# EAGLE design main (EAGLE 6.4)
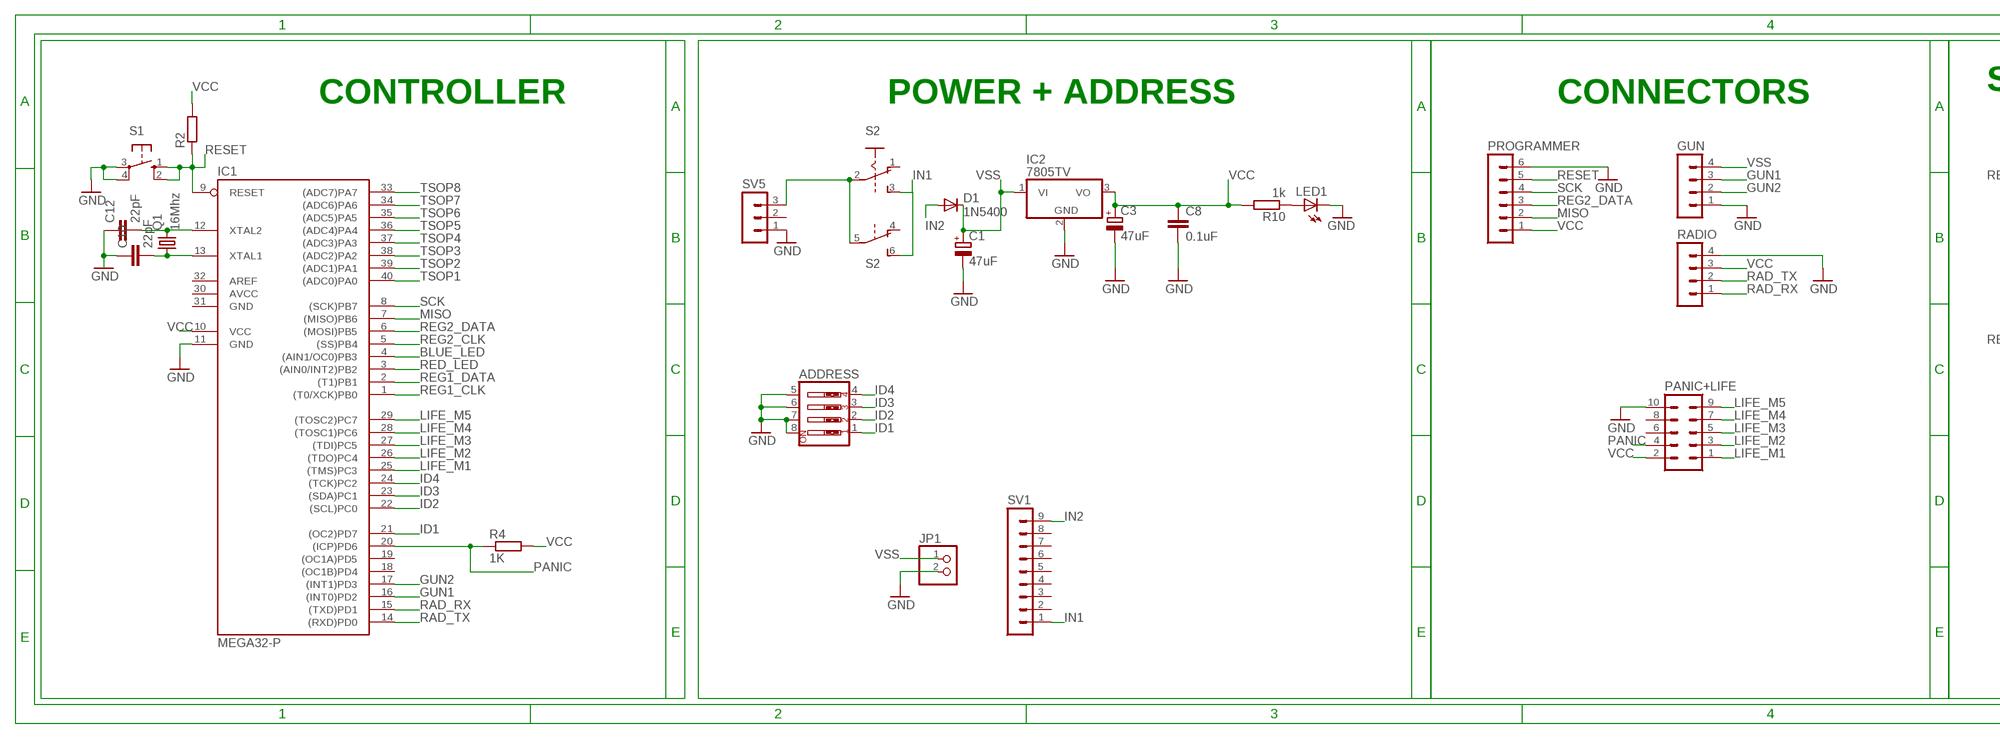
[diagram p0: schematic, sheet 1, part 1 of 2]
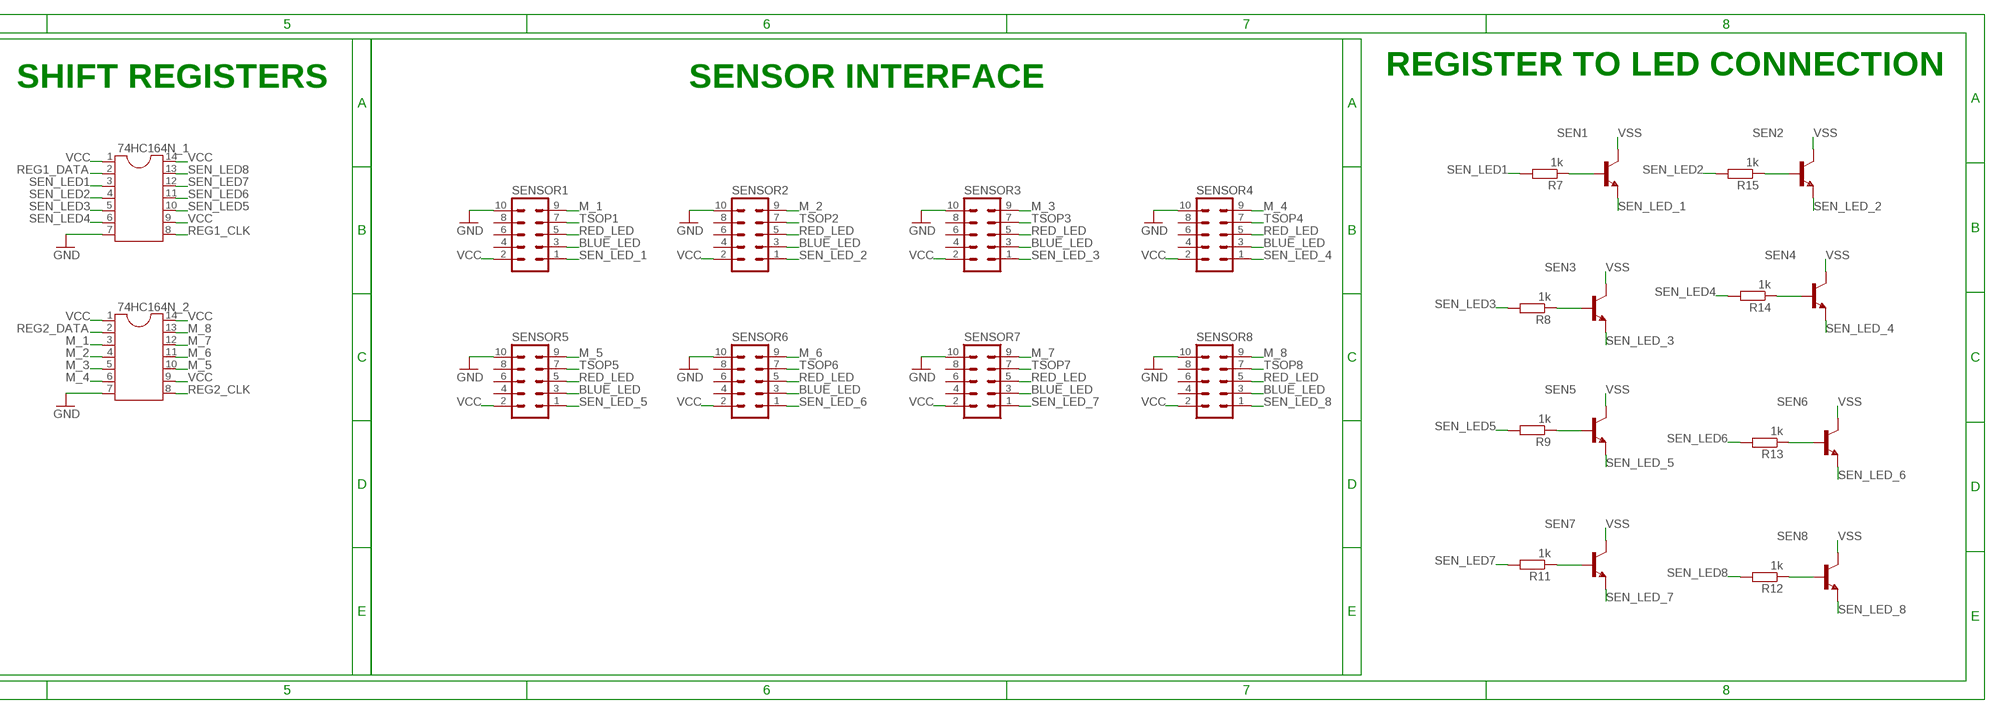
[diagram p1: schematic, sheet 1, part 2 of 2]

## Parts
74HC164N_1  DIL14  [DIL14]
74HC164N_2  DIL14  [DIL14]
ADDRESS  SW_DIP-4  [EDG-04]
C1  47uF  CPOL-EUE2.5-6  [E2,5-6]
C3  47uF  CPOL-EUE2.5-6  [E2,5-6]
C8  0.1uF  C-EU025-025X050  [C025-025X050]
C10  22pF  C-EU025-025X050  [C025-025X050]
C12  22pF  C-EU025-025X050  [C025-025X050]
D1  1N5400  [DO201-15]
GUN  MA04-1  [MA04-1]
IC1  MEGA32-P  [DIL40]
IC2  7805TV  [TO220V]
JP1  PINHD-1X2  [1X02]
LED1  LED5MM  [LED5MM]
PANIC+LIFE  ML10  [ML10]
PROGRAMMER  MA06-1  [MA06-1]
Q1  16Mhz  CRYSTALHC49U70  [HC49U70]
R2  R-EU_0207/10  [0207/10]
R4  1K  R-EU_0207/10  [0207/10]
R7  1k  R-EU_0207/10  [0207/10]
R8  1k  R-EU_0207/10  [0207/10]
R9  1k  R-EU_0207/10  [0207/10]
R10  1k  R-EU_0207/10  [0207/10]
R11  1k  R-EU_0207/10  [0207/10]
R12  1k  R-EU_0207/10  [0207/10]
R13  1k  R-EU_0207/10  [0207/10]
R14  1k  R-EU_0207/10  [0207/10]
R15  1k  R-EU_0207/10  [0207/10]
RADIO  MA04-1  [MA04-1]
S1  10-XX  [B3F-10XX]
S2  A68-A31  [A68-A31]
SEN1  BC547  [TO92]
SEN2  BC547  [TO92]
SEN3  BC547  [TO92]
SEN4  BC547  [TO92]
SEN5  BC547  [TO92]
SEN6  BC547  [TO92]
SEN7  BC547  [TO92]
SEN8  BC547  [TO92]
SENSOR1  ML10  [ML10]
SENSOR2  ML10  [ML10]
SENSOR3  ML10  [ML10]
SENSOR4  ML10  [ML10]
SENSOR5  ML10  [ML10]
SENSOR6  ML10  [ML10]
SENSOR7  ML10  [ML10]
SENSOR8  ML10  [ML10]
SV1  MA09-1  [MA09-1]
SV5  MA03-1  [MA03-1]

## Nets
BLUE_LED: IC1.4((AIN1/OC0)PB3) SENSOR1.3 SENSOR2.3 SENSOR3.3 SENSOR4.3 SENSOR5.3 SENSOR6.3 SENSOR7.3 SENSOR8.3
GND: 74HC164N_1.7 74HC164N_2.7 ADDRESS.5 ADDRESS.6 ADDRESS.7 ADDRESS.8 C1.- C3.- C8.2 C10.1 C12.1 GUN.1 IC1.11(GND) IC2.2(GND) JP1.2 LED1.K(C) PANIC+LIFE.10 PROGRAMMER.6 RADIO.4 S1.3(P) S1.4(P1) SENSOR1.10 SENSOR2.10 SENSOR3.10 SENSOR4.10 SENSOR5.10 SENSOR6.10 SENSOR7.10 SENSOR8.10 SV5.1
GUN1: GUN.3 IC1.16((INT0)PD2)
GUN2: GUN.2 IC1.17((INT1)PD3)
ID1: ADDRESS.1 IC1.21((OC2)PD7)
ID2: ADDRESS.2 IC1.22((SCL)PC0)
ID3: ADDRESS.3 IC1.23((SDA)PC1)
ID4: ADDRESS.4 IC1.24((TCK)PC2)
IN1: S2.3(A:S) S2.6(B:S) SV1.1
IN2: D1.A SV1.9
LIFE_M1: IC1.25((TMS)PC3) PANIC+LIFE.1
LIFE_M2: IC1.26((TDO)PC4) PANIC+LIFE.3
LIFE_M3: IC1.27((TDI)PC5) PANIC+LIFE.5
LIFE_M4: IC1.28((TOSC1)PC6) PANIC+LIFE.7
LIFE_M5: IC1.29((TOSC2)PC7) PANIC+LIFE.9
M_1: 74HC164N_2.3 SENSOR1.9
M_2: 74HC164N_2.4 SENSOR2.9
M_3: 74HC164N_2.5 SENSOR3.9
M_4: 74HC164N_2.6 SENSOR4.9
M_5: 74HC164N_2.10 SENSOR5.9
M_6: 74HC164N_2.11 SENSOR6.9
M_7: 74HC164N_2.12 SENSOR7.9
M_8: 74HC164N_2.13 SENSOR8.9
MISO: IC1.7((MISO)PB6) PROGRAMMER.2
N$2: C12.2 IC1.12(XTAL2) Q1.2
N$3: C10.2 IC1.13(XTAL1) Q1.1
N$4: LED1.A R10.1
N$7: R7.1 SEN1.2(B)
N$8: R15.1 SEN2.2(B)
N$10: S2.2(A:P) S2.5(B:P) SV5.3
N$12: R8.1 SEN3.2(B)
N$14: R14.1 SEN4.2(B)
N$16: R9.1 SEN5.2(B)
N$18: R13.1 SEN6.2(B)
N$20: R11.1 SEN7.2(B)
N$22: R12.1 SEN8.2(B)
PANIC: IC1.20((ICP)PD6) PANIC+LIFE.4 R4.1
RAD_RX: IC1.15((TXD)PD1) RADIO.1
RAD_TX: IC1.14((RXD)PD0) RADIO.2
RED_LED: IC1.3((AIN0/INT2)PB2) SENSOR1.5 SENSOR2.5 SENSOR3.5 SENSOR4.5 SENSOR5.5 SENSOR6.5 SENSOR7.5 SENSOR8.5
REG1_CLK: 74HC164N_1.8 IC1.1((T0/XCK)PB0)
REG1_DATA: 74HC164N_1.2 IC1.2((T1)PB1)
REG2_CLK: 74HC164N_2.8 IC1.5((SS)PB4)
REG2_DATA: 74HC164N_2.2 IC1.6((MOSI)PB5) PROGRAMMER.3
RESET: IC1.9(RESET) PROGRAMMER.5 R2.1 S1.1(S) S1.2(S1)
SCK: IC1.8((SCK)PB7) PROGRAMMER.4
SEN_LED1: 74HC164N_1.3 R7.2
SEN_LED2: 74HC164N_1.4 R15.2
SEN_LED3: 74HC164N_1.5 R8.2
SEN_LED4: 74HC164N_1.6 R14.2
SEN_LED5: 74HC164N_1.10 R9.2
SEN_LED6: 74HC164N_1.11 R13.2
SEN_LED7: 74HC164N_1.12 R11.2
SEN_LED8: 74HC164N_1.13 R12.2
SEN_LED_1: SEN1.1(E) SENSOR1.1
SEN_LED_2: SEN2.1(E) SENSOR2.1
SEN_LED_3: SEN3.1(E) SENSOR3.1
SEN_LED_4: SEN4.1(E) SENSOR4.1
SEN_LED_5: SEN5.1(E) SENSOR5.1
SEN_LED_6: SEN6.1(E) SENSOR6.1
SEN_LED_7: SEN7.1(E) SENSOR7.1
SEN_LED_8: SEN8.1(E) SENSOR8.1
TSOP1: IC1.40((ADC0)PA0) SENSOR1.7
TSOP2: IC1.39((ADC1)PA1) SENSOR2.7
TSOP3: IC1.38((ADC2)PA2) SENSOR3.7
TSOP4: IC1.37((ADC3)PA3) SENSOR4.7
TSOP5: IC1.36((ADC4)PA4) SENSOR5.7
TSOP6: IC1.35((ADC5)PA5) SENSOR6.7
TSOP7: IC1.34((ADC6)PA6) SENSOR7.7
TSOP8: IC1.33((ADC7)PA7) SENSOR8.7
VCC: 74HC164N_1.1 74HC164N_1.9 74HC164N_1.14 74HC164N_2.1 74HC164N_2.9 74HC164N_2.14 C3.+ C8.1 IC1.10(VCC) IC2.3(VO) PANIC+LIFE.2 PROGRAMMER.1 R2.2 R4.2 R10.2 RADIO.3 SENSOR1.2 SENSOR2.2 SENSOR3.2 SENSOR4.2 SENSOR5.2 SENSOR6.2 SENSOR7.2 SENSOR8.2
VSS: C1.+ D1.C GUN.4 IC2.1(VI) JP1.1 SEN1.3(C) SEN2.3(C) SEN3.3(C) SEN4.3(C) SEN5.3(C) SEN6.3(C) SEN7.3(C) SEN8.3(C)
Unconnected: IC1.18((OC1B)PD4) IC1.19((OC1A)PD5) IC1.32(AREF) PANIC+LIFE.6 PANIC+LIFE.8 S2.1(A:O) S2.4(B:O) SENSOR1.4 SENSOR1.6 SENSOR1.8 SENSOR2.4 SENSOR2.6 SENSOR2.8 SENSOR3.4 SENSOR3.6 SENSOR3.8 SENSOR4.4 SENSOR4.6 SENSOR4.8 SENSOR5.4 SENSOR5.6 SENSOR5.8 SENSOR6.4 SENSOR6.6 SENSOR6.8 SENSOR7.4 SENSOR7.6 SENSOR7.8 SENSOR8.4 SENSOR8.6 SENSOR8.8 SV1.2 SV1.3 SV1.4 SV1.5 SV1.6 SV1.7 SV1.8 SV5.2

## Notes on the sheet
- REGISTER TO LED CONNECTION
- SHIFT REGISTERS | SENSOR INTERFACE
- CONTROLLER | POWER + ADDRESS | CONNECTORS

## Power pins joined to a net without a drawn wire
AVCC: IC1.30(AVCC)
GND: IC1.31(GND)

## Library data of the parts
74HC164N_1 74HC164N_2 = ic-package:DIL14: Dual In Line / Socket
ADDRESS = special:SW_DIP-4: DIP SWITCH
C1 C3 = rcl:CPOL-EU: POLARIZED CAPACITOR, European symbol
C8 C10 C12 = rcl:C-EU: CAPACITOR, European symbol
D1 = diode:1N5400: DIODE standard rectifier, 3 A, 50 V (Motorola)
GUN RADIO = con-lstb:MA04-1: PIN HEADER; OC_FARNELL: unknown; OC_NEWARK: unknown
IC1 = atmel:MEGA32-P: MICROCONTROLLER 32 Kbytes FLASH 2 Kbytes SRAM 1 Kbytes EEPROM USART 8-channel 10 bit ADC Source: www.atmel.com .. doc2503.pdf; MPN: ATMEGA32-16PU; OC_FARNELL: 1661729; OC_NEWARK: 51P1794
IC2 = linear:78*: Positive VOLTAGE REGULATOR Source: http://cache.national.com/ds/LM/LM78L05.pdf http://www.fairchildsemi.com/ds/LM/LM7805.pdf
JP1 = pinhead:PINHD-1X2: PIN HEADER
LED1 = SparkFun:LED: LEDs Standard schematic elements and footprints for 5mm, 3mm, 1206, and 0603 sized LEDs. 5mm - Spark Fun Electronics SKU : COM-00529 (and others)
PANIC+LIFE SENSOR1-SENSOR8 = con-harting-ml:ML10: HARTING; OC_FARNELL: unknown; OC_NEWARK: unknown
PROGRAMMER = con-lstb:MA06-1: PIN HEADER; OC_FARNELL: unknown; OC_NEWARK: unknown
Q1 = crystal:CRYSTAL: CRYSTAL; OC_FARNELL: unknown; OC_NEWARK: unknown
R2 R4 R7-R15 = rcl:R-EU_: RESISTOR, European symbol
S1 = switch-omron:10-XX: OMRON SWITCH; MPN: B3F-1000; OC_FARNELL: 176432; OC_NEWARK: 36M3542
S2 = switch:A68-A31: SLIDING SWITCH Siemens, distributor Buerklin, 11G766
SEN1-SEN8 = transistor:BC547: NPN TRANSISTOR
SV1 = con-lstb:MA09-1: PIN HEADER; OC_FARNELL: unknown; OC_NEWARK: unknown
SV5 = con-lstb:MA03-1: PIN HEADER; OC_FARNELL: unknown; OC_NEWARK: unknown

## Board
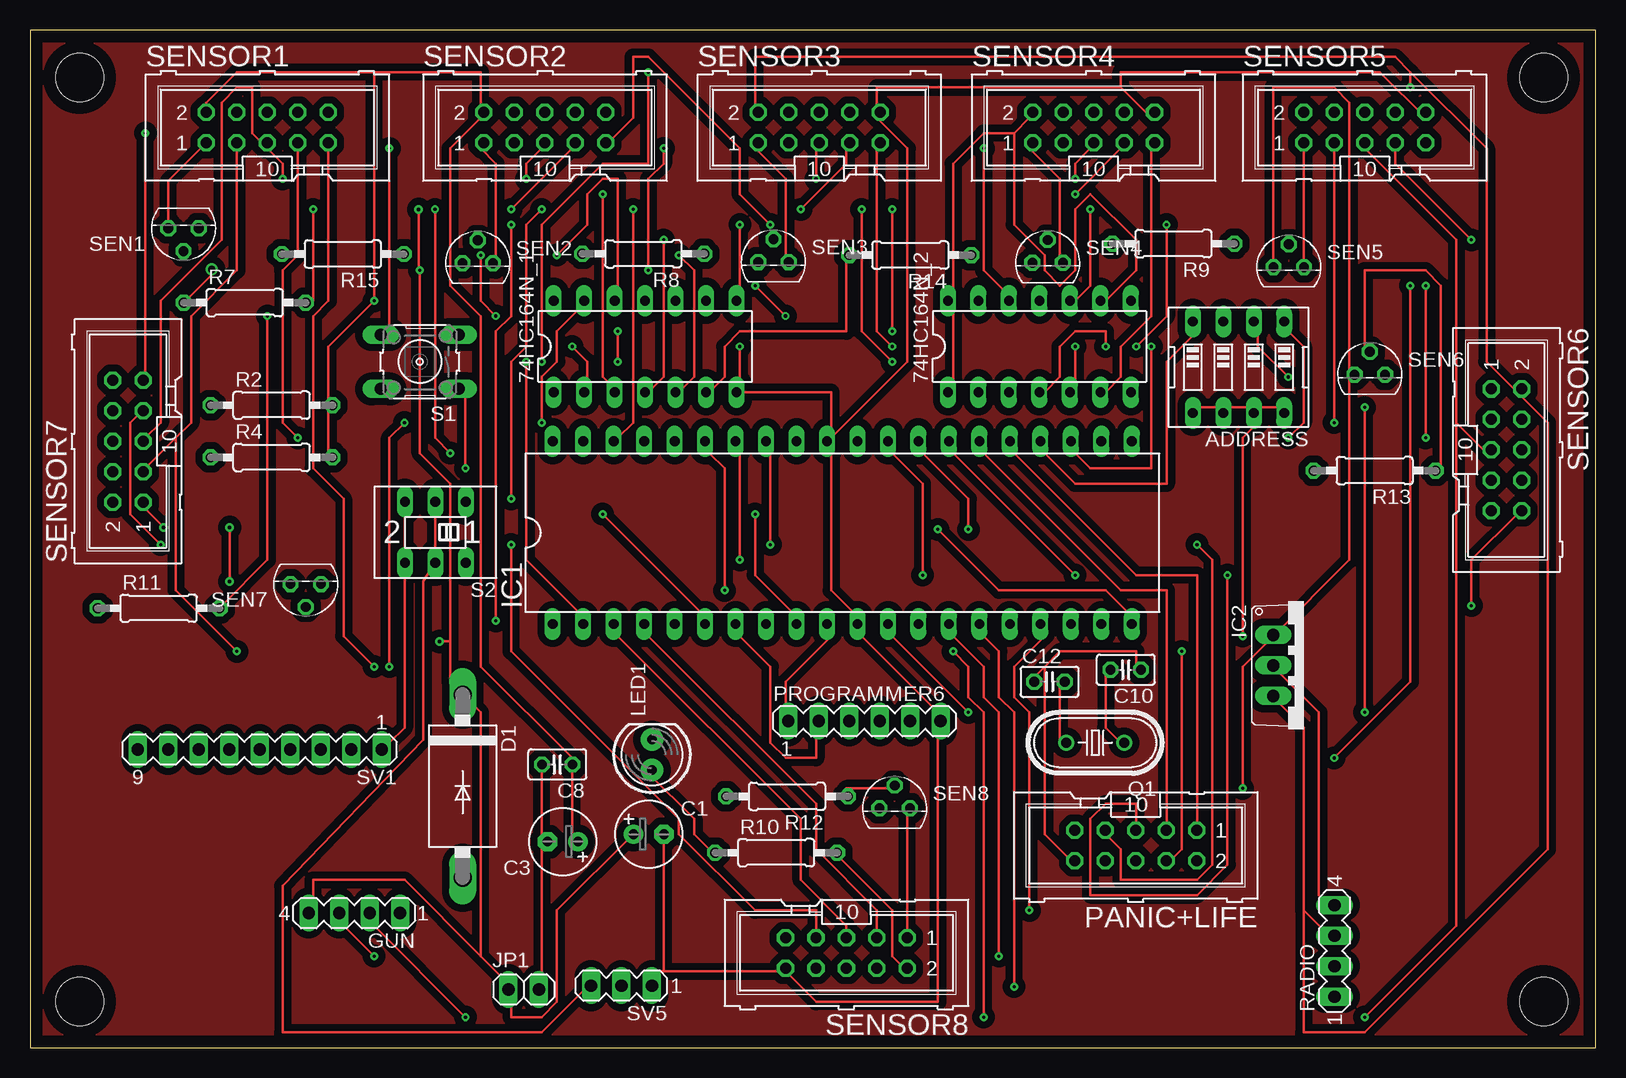
[diagram p2: board, top side]
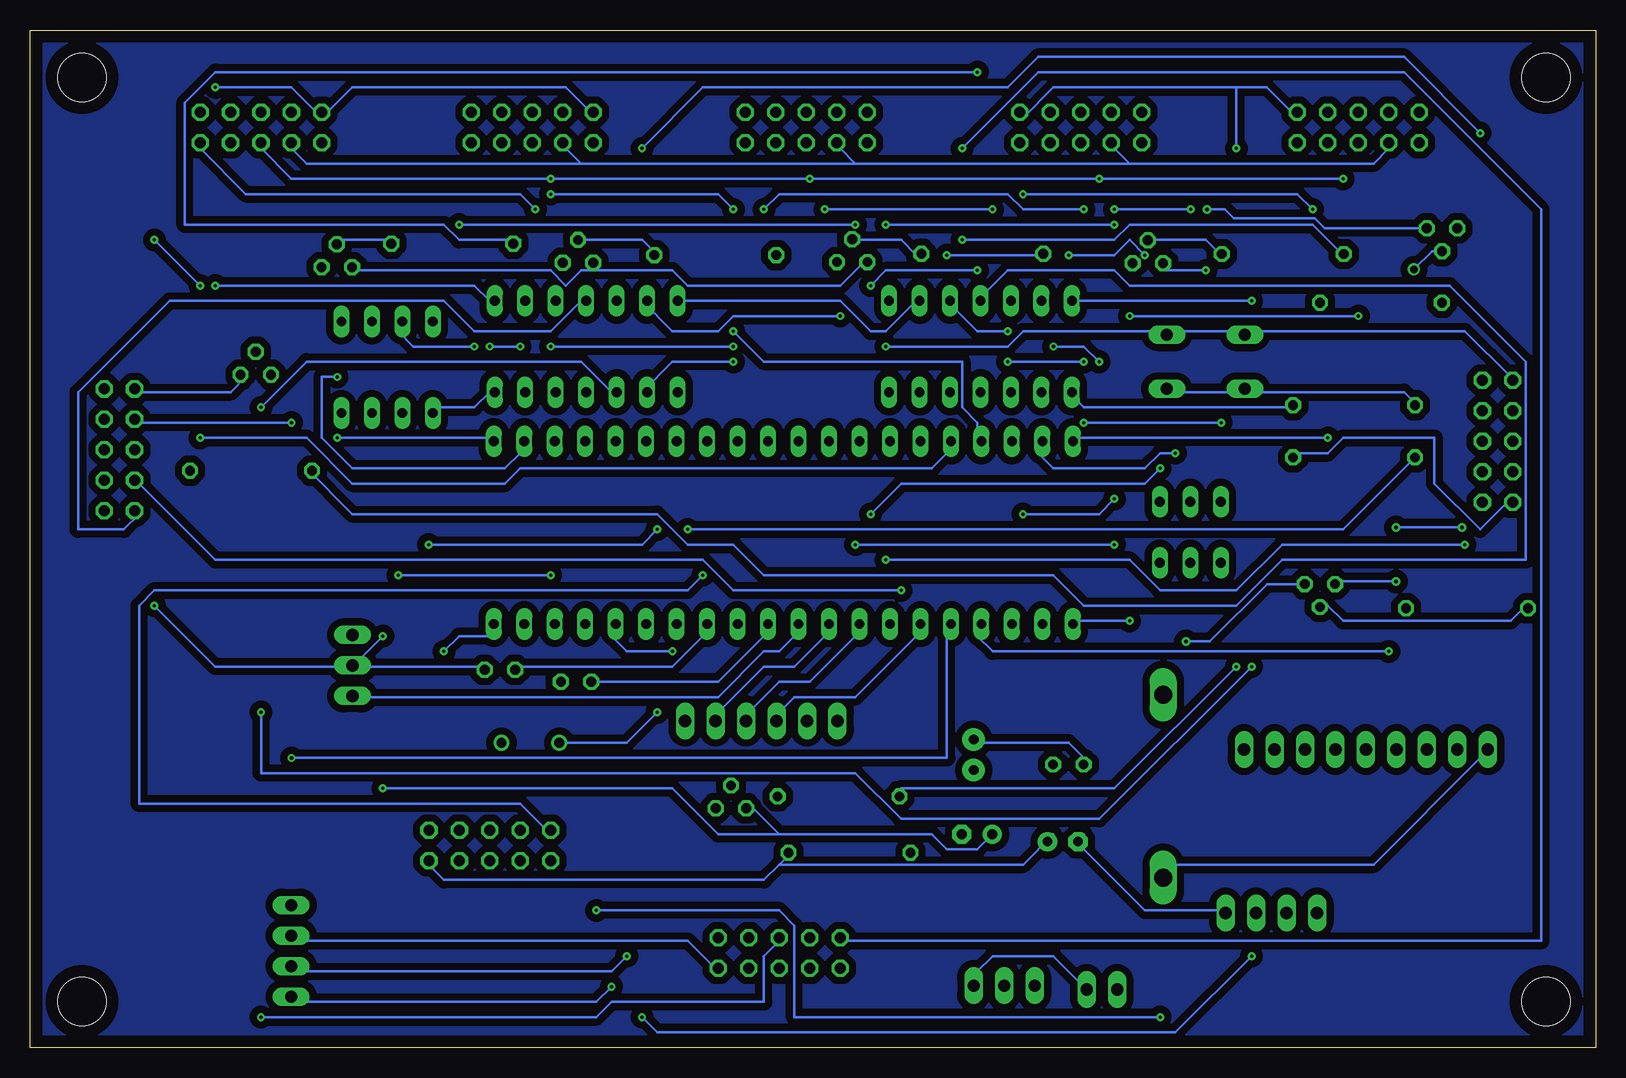
[diagram p3: board, bottom side, seen from below]

Size 130.47 x 84.8 mm. Coordinates in mm from the lower left corner, seen from the top.
Outline: 0,0 130.47,0 130.47,84.8 0,84.8 0,0
Copper layers (1*16): Top 0.035mm / dielectric 1.5mm / Bottom 0.035mm
Design rules "default *": minimum track width 5mil, minimum drill 10mil, track to track 5mil, track to pad 5mil, pad to pad 5mil, via to via 5mil, smd to smd 5mil, copper to edge 40mil, drill to drill 5mil, minimum pad ring 10mil, minimum via ring 8mil, stop-mask expansion 4mil, vias tented up to drill 0mil, thermal gap 10mil
Holes 4 mm at 4.14,80.84 126.14,80.84 126.14,3.84 4.14,3.84

### Footprints (pad centres in the part's own frame; a part is rotated, then mirrored left to right if it is on the bottom)
DIL14 = drill 0.813 long: 1 -7.62,-3.81; 2 -5.08,-3.81; 3 -2.54,-3.81; 4 0,-3.81; 5 2.54,-3.81; 6 5.08,-3.81; 7 7.62,-3.81; 8 7.62,3.81; 9 5.08,3.81; 10 2.54,3.81; 11 0,3.81; 12 -2.54,3.81; 13 -5.08,3.81; 14 -7.62,3.81
EDG-04 = drill 0.813 long: 1 -3.81,-3.81; 2 -1.27,-3.81; 3 1.27,-3.81; 4 3.81,-3.81; 5 3.81,3.81; 6 1.27,3.81; 7 -1.27,3.81; 8 -3.81,3.81
E2,5-6 = drill 0.813 pad 1.6: + -1.27,0 | drill 0.813 pad 1.6 octagon: - 1.27,0
C025-025X050 = drill 0.813 octagon: 1 -1.27,0; 2 1.27,0
DO201-15 = drill 1.499 long: A 7.62,0; C -7.62,0
MA04-1 = drill 1.016 long: 1 -3.81,0; 2 -1.27,0; 3 1.27,0; 4 3.81,0
DIL40 = drill 0.813 long: 1 -24.13,-7.62; 2 -21.59,-7.62; 3 -19.05,-7.62; 4 -16.51,-7.62; 5 -13.97,-7.62; 6 -11.43,-7.62; 7 -8.89,-7.62; 8 -6.35,-7.62; 9 -3.81,-7.62; 10 -1.27,-7.62; 11 1.27,-7.62; 12 3.81,-7.62; 13 6.35,-7.62; 14 8.89,-7.62; 15 11.43,-7.62; 16 13.97,-7.62; 17 16.51,-7.62; 18 19.05,-7.62; 19 21.59,-7.62; 20 24.13,-7.62; 21 24.13,7.62; 22 21.59,7.62; 23 19.05,7.62; 24 16.51,7.62; 25 13.97,7.62; 26 11.43,7.62; 27 8.89,7.62; 28 6.35,7.62; 29 3.81,7.62; 30 1.27,7.62; 31 -1.27,7.62; 32 -3.81,7.62; 33 -6.35,7.62; 34 -8.89,7.62; 35 -11.43,7.62; 36 -13.97,7.62; 37 -16.51,7.62; 38 -19.05,7.62; 39 -21.59,7.62; 40 -24.13,7.62
TO220V = drill 1.016 long: 1 -2.54,-2.54; 2 0,-2.54; 3 2.54,-2.54
1X02 = drill 1.016 long: 1 -1.27,0; 2 1.27,0
LED5MM = drill 0.813 pad 1.88: A -1.27,0; K 1.27,0
ML10 = drill 0.914 octagon: 1 -5.08,-1.27; 2 -5.08,1.27; 3 -2.54,-1.27; 4 -2.54,1.27; 5 0,-1.27; 6 0,1.27; 7 2.54,-1.27; 8 2.54,1.27; 9 5.08,-1.27; 10 5.08,1.27
MA06-1 = drill 1.016 long: 1 -6.35,0; 2 -3.81,0; 3 -1.27,0; 4 1.27,0; 5 3.81,0; 6 6.35,0
HC49U70 = drill 0.813: 1 -2.413,0; 2 2.413,0
0207/10 = drill 0.813 octagon: 1 -5.08,0; 2 5.08,0
B3F-10XX = drill 1.016 long: 1 -3.251,2.261; 2 3.251,2.261; 3 -3.251,-2.261; 4 3.251,-2.261
A68-A31 = drill 0.813 long: 1 -2.54,-2.54; 2 0,-2.54; 3 2.54,-2.54; 4 -2.54,2.54; 5 0,2.54; 6 2.54,2.54
TO92 = drill 0.813 octagon: 1 1.27,0; 2 0,1.905; 3 -1.27,0
MA09-1 = drill 1.016 long: 1 -10.16,0; 2 -7.62,0; 3 -5.08,0; 4 -2.54,0; 5 0,0; 6 2.54,0; 7 5.08,0; 8 7.62,0; 9 10.16,0
MA03-1 = drill 1.016 long: 1 -2.54,0; 2 0,0; 3 2.54,0

### Placement (x,y rotation side)
74HC164N_1  51.26,58.42 0 top
74HC164N_2  84.12,58.42 0 top
ADDRESS  100.71,56.69 180 top
C1  51.56,17.78 0 top
C3  44.4,17.16 180 top
C8  43.94,23.59 180 top
C10  91.31,31.48 180 top
C12  84.96,30.48 0 top
D1  36.05,21.78 270 top
GUN  27.03,11.21 180 top
IC1  67.69,42.91 0 top
IC2  106.14,31.84 270 top
JP1  41.14,4.84 0 top
LED1  51.83,24.4 90 top
PANIC+LIFE  92.14,16.84 180 top
PROGRAMMER  69.53,27.21 0 top
Q1  88.77,25.4 180 top
R2  20.13,53.53 0 top
R4  20.13,49.18 0 top
R7  17.89,62.08 0 top
R8  51.11,66.15 180 top
R9  95.28,66.99 180 top
R10  62.18,16.24 0 top
R11  10.72,36.61 0 top
R12  63.09,20.93 180 top
R13  112.05,48.08 180 top
R14  73.36,66.03 180 top
R15  26.07,66.12 180 top
RADIO  108.71,8.05 90 top
S1  32.48,57.15 180 top
S2  33.78,42.94 180 top
SEN1  12.8,68.27 180 top
SEN2  37.31,65.36 0 top
SEN3  61.95,65.45 0 top
SEN4  84.81,65.4 0 top
SEN5  104.9,65.03 0 top
SEN6  111.65,56.08 0 top
SEN7  22.98,38.62 180 top
SEN8  72.06,19.93 0 top
SENSOR1  19.78,76.66 0 top
SENSOR2  42.91,76.66 0 top
SENSOR3  65.77,76.66 0 top
SENSOR4  88.63,76.66 0 top
SENSOR5  111.22,76.66 0 top
SENSOR6  123.03,49.8 270 top
SENSOR7  8.16,50.53 90 top
SENSOR8  68.04,7.89 180 top
SV1  19.14,24.84 180 top
SV5  49.29,5.16 180 top

### Tracks (layer width: path | path; a pad name or v marks a point on that pad's centre or on a via)
BLUE_LED  (via drill 0.25)
  Top 0.203: IC1.4 51.53,34.29 65.5,20.32 65.5,16.51 70.58,11.43 SENSOR8.3 70.58,8.89 | 12.16,50.8 13.43,52.07 13.43,60.96 17.24,64.77 SENSOR1.3 | 12.16,50.8 9.62,48.26 SENSOR7.3 | SENSOR5.3 v108.68,52.07 | v17.24,33.02 12.16,38.1 12.16,50.8
  Bottom 0.203: 38.83,73.66 40.1,74.93 SENSOR2.3 | 38.83,73.66 18.51,73.66 17.24,74.93 SENSOR1.3 | 61.69,73.66 62.96,74.93 SENSOR3.3 | 38.83,73.66 61.69,73.66 | 84.55,73.66 85.82,74.93 SENSOR4.3 | 61.69,73.66 84.55,73.66 | 84.55,73.66 107.41,73.66 108.68,74.93 SENSOR5.3 | v108.68,52.07 121.38,52.07 SENSOR6.3 | v17.24,33.02 50.26,33.02 51.53,34.29 IC1.4
GND  (via drill 0.25)
  Top 0.203: 84.55,31.75 85.82,33.02 92.17,33.02 92.17,31.75 C10.1 | 84.55,31.75 83.28,30.48 C12.1 | 84.55,31.75 84.55,17.78 87.09,15.24 PANIC+LIFE.10 | 99.79,53.34 97.25,53.34 ADDRESS.5 | 99.79,53.34 102.33,53.34 | 99.79,53.34 ADDRESS.6 | 102.33,53.34 104.87,53.34 ADDRESS.8 | 102.33,53.34 ADDRESS.7 102.33,52.07 101.06,50.8 v101.06,34.29 | v120.11,36.83 120.11,40.64 123.92,44.45 SENSOR6.10 | RADIO.4 108.68,11.43 107.41,12.7 107.41,27.94 103.6,31.75 IC2.2 | v29.94,74.93 29.94,59.69 S1.4 | 52.8,6.35 51.53,6.35 SV5.1 | 52.8,6.35 62.96,6.35 | 52.8,6.35 52.8,17.78 C1.- | 42.64,17.78 42.64,24.13 C8.2 | 42.64,17.78 42.64,5.08 JP1.2 | 42.64,17.78 C3.- | 59.15,54.61 66.77,54.61 66.77,50.8 | 70.58,77.47 73.12,74.93 73.12,57.15 66.77,50.8 | 66.77,50.8 IC1.31 66.77,49.53 66.77,38.1 69.31,35.56 IC1.11 69.31,34.29 75.66,27.94 PROGRAMMER.6 75.66,26.67 75.66,3.81 65.5,3.81 62.96,6.35 | 90.9,80.01 93.44,77.47 SENSOR4.10 | 90.9,80.01 70.58,80.01 70.58,77.47 | 70.58,77.47 SENSOR3.10 | 90.9,80.01 90.9,81.28 112.49,81.28 116.3,77.47 SENSOR5.10 | 62.96,6.35 SENSOR8.10 | 59.15,54.61 v59.15,58.42 | 59.15,54.61 74HC164N_1.7
  Bottom 0.203: 74HC164N_2.7 92.17,54.61 93.44,53.34 97.25,53.34 ADDRESS.5 | v120.11,36.83 115.03,31.75 103.6,31.75 | 103.6,31.75 v101.06,34.29 | 103.6,31.75 92.17,31.75 C10.1 | 103.6,31.75 IC2.2 | 29.94,80.01 45.18,80.01 47.72,77.47 SENSOR2.10 | 29.94,80.01 27.4,80.01 24.86,77.47 SENSOR1.10 | SENSOR7.10 7.08,55.88 10.89,59.69 28.67,59.69 S1.4 29.94,59.69 35.02,59.69 S1.3 36.29,59.69 47.72,59.69 48.99,58.42 v59.15,58.42 | v29.94,74.93 29.94,80.01 | GUN.1 31.21,11.43 37.56,11.43 42.64,16.51 42.64,17.78 C3.- | LED1.K 51.53,25.4 43.91,25.4 42.64,24.13 C8.2 | SV5.1 51.53,6.35 50.26,7.62 45.18,7.62 42.64,5.08 JP1.2 | C12.1 73.12,30.48 69.31,34.29 IC1.11
GUN1  (via drill 0.25)
  Top 0.203: v76.93,33.02 78.2,31.75 78.2,29.21 79.47,27.94 v79.47,2.54 | v28.67,7.62 26.13,10.16 GUN.3
  Bottom 0.203: v76.93,33.02 80.74,33.02 82.01,34.29 IC1.16 | v79.47,2.54 78.2,1.27 35.02,1.27 v28.67,7.62
GUN2  (via drill 0.25)
  Top 0.203: v83.28,11.43 83.28,27.94 82.01,29.21 82.01,31.75 84.55,34.29 IC1.17 | v36.29,2.54 28.67,10.16 GUN.2
  Bottom 0.203: v83.28,11.43 68.04,11.43 66.77,10.16 66.77,2.54 v36.29,2.54
ID1  (via drill 0.25)
  Top 0.203: v104.87,50.8 106.14,52.07 106.14,58.42 104.87,59.69 ADDRESS.1
  Bottom 0.203: v104.87,50.8 92.17,50.8 IC1.21
ID2  (via drill 0.25)
  Top 0.203: v104.87,55.88 102.33,58.42 102.33,59.69 ADDRESS.2
  Bottom 0.203: v104.87,55.88 106.14,55.88 106.14,50.8 103.6,48.26 90.9,48.26 89.63,49.53 IC1.22
ID3  (via drill 0.25)
  Top 0.203: v93.44,58.42 93.44,48.26 88.36,48.26 87.09,49.53 IC1.23
  Bottom 0.203: v93.44,58.42 98.52,58.42 99.79,59.69 ADDRESS.3
ID4
  Top 0.203: IC1.24 84.55,49.53 87.09,46.99 94.71,46.99 94.71,57.15 97.25,59.69 ADDRESS.4
IN1
  Top 0.203: S2.3 31.21,44.45 31.21,40.64 S2.6 31.21,39.37 31.21,26.67 29.94,25.4 SV1.1
IN2
  Bottom 0.203: SV1.9 9.62,24.13 18.51,15.24 35.02,15.24 D1.A
LIFE_M1
  Top 0.203: IC1.25 82.01,49.53 92.17,39.37 97.25,39.37 97.25,17.78 PANIC+LIFE.1
LIFE_M2
  Top 0.203: IC1.26 79.47,49.53 90.9,38.1 94.71,38.1 94.71,17.78 PANIC+LIFE.3
LIFE_M3  (via drill 0.25)
  Top 0.203: v87.09,39.37 76.93,49.53 IC1.27 | v99.79,39.37 99.79,15.24 97.25,12.7 88.36,12.7 88.36,19.05 89.63,20.32 92.17,20.32 92.17,17.78 PANIC+LIFE.5
  Bottom 0.203: v99.79,39.37 v87.09,39.37
LIFE_M4  (via drill 0.25)
  Top 0.203: v78.2,43.18 78.2,45.72 74.39,49.53 IC1.28 | v97.25,41.91 98.52,40.64 98.52,15.24 97.25,13.97 90.9,13.97 90.9,16.51 89.63,17.78 PANIC+LIFE.7
  Bottom 0.203: v78.2,43.18 79.47,41.91 v97.25,41.91
LIFE_M5  (via drill 0.25)
  Top 0.203: v74.39,39.37 74.39,46.99 71.85,49.53 IC1.29
  Bottom 0.203: v74.39,39.37 75.66,38.1 120.11,38.1 121.38,36.83 121.38,20.32 89.63,20.32 87.09,17.78 PANIC+LIFE.9
M_1  (via drill 0.25)
  Top 0.203: v111.22,27.94 v111.22,53.34 | v28.67,31.75 26.13,34.29 26.13,45.72 23.59,48.26 23.59,60.96 24.86,62.23 SENSOR1.9
  Bottom 0.203: v111.22,53.34 107.41,57.15 84.55,57.15 82.01,54.61 74HC164N_2.3 | v111.22,27.94 111.22,22.86 61.69,22.86 57.88,19.05 41.37,19.05 v28.67,31.75
M_2  (via drill 0.25)
  Top 0.203: v89.63,58.42 89.63,59.69 87.09,59.69 85.82,58.42 85.82,55.88 84.55,54.61 74HC164N_2.4 | v92.17,58.42 94.71,60.96 v94.71,68.58 | v61.69,68.58 59.15,71.12 59.15,74.93 51.53,82.55 50.26,82.55 50.26,77.47 47.72,74.93 SENSOR2.9
  Bottom 0.203: v92.17,58.42 v89.63,58.42 | v61.69,68.58 v94.71,68.58
M_3  (via drill 0.25)
  Top 0.203: v87.09,58.42 87.09,54.61 74HC164N_2.5 | v71.85,58.42 70.58,59.69 70.58,74.93 SENSOR3.9
  Bottom 0.203: v71.85,58.42 v87.09,58.42
M_4
  Top 0.203: 74HC164N_2.6 89.63,54.61 90.9,55.88 90.9,58.42 93.44,60.96 93.44,74.93 SENSOR4.9
M_5  (via drill 0.25)
  Top 0.203: v88.36,69.85 88.36,63.5 87.09,62.23 74HC164N_2.10
  Bottom 0.203: v88.36,69.85 89.63,71.12 112.49,71.12 116.3,74.93 SENSOR5.9
M_6
  Bottom 0.203: 74HC164N_2.11 84.55,62.23 87.09,59.69 93.44,59.69 95.98,62.23 118.84,62.23 126.46,54.61 126.46,43.18 122.65,43.18 121.38,44.45 SENSOR6.9
M_7  (via drill 0.25)
  Top 0.203: v79.47,74.93 79.47,64.77 82.01,62.23 74HC164N_2.12 | v9.62,76.2 9.62,55.88 SENSOR7.9
  Bottom 0.203: v79.47,74.93 74.39,80.01 48.99,80.01 46.45,82.55 15.97,82.55 v9.62,76.2
M_8  (via drill 0.25)
  Top 0.203: v60.42,63.5 v62.96,60.96 | v51.53,64.77 51.53,72.39 52.8,73.66 v52.8,74.93
  Bottom 0.203: v62.96,60.96 71.85,60.96 73.12,59.69 76.93,59.69 79.47,62.23 74HC164N_2.13 | v60.42,63.5 59.15,64.77 v51.53,64.77 | v52.8,74.93 46.45,81.28 15.97,81.28 4.54,69.85 4.54,8.89 62.96,8.89 SENSOR8.9
MISO
  Top 0.203: IC1.7 59.15,34.29 61.69,31.75 61.69,25.4 62.96,24.13 65.5,24.13 65.5,26.67 PROGRAMMER.2
N$1
  pour Top (isolate 0.61): 0.64,84.34 0.64,0.34 130.14,0.34 130.14,84.34
N$2  (via drill 0.25)
  Top 0.203: C12.2 85.82,30.48 85.82,25.4 Q1.2 | v78.2,27.94 71.85,34.29 IC1.12
  Bottom 0.203: v78.2,27.94 80.74,25.4 Q1.2
N$3
  Top 0.203: Q1.1 90.9,25.4 89.63,26.67 89.63,31.75 C10.2
  Bottom 0.203: IC1.13 74.39,34.29 76.93,31.75 89.63,31.75 C10.2
N$4
  Top 0.203: R10.1 56.61,16.51 55.34,17.78 55.34,19.05 51.53,22.86 LED1.A
N$5
  pour Bottom (isolate 0.61): 0.64,84.34 0.64,0.34 130.14,0.34 130.14,84.34
N$7  (via drill 0.6)
  Top 0.203: v15.14,64.84 15.14,64.41 R7.1
  Bottom 0.203: SEN1.2 13.62,66.37 v15.14,64.84
N$8
  Bottom 0.203: R15.1 31.21,66.04 32.48,67.31 37.56,67.31 SEN2.2
N$10
  Top 0.203: S2.2 33.75,44.45 33.75,40.64 S2.5 32.75,38.87 32.75,25.67 21.05,13.47 21.05,1.27 42.64,1.27 46.45,5.08 SV5.3
N$12
  Bottom 0.203: R8.1 56.61,66.04 57.88,67.31 61.69,67.31 SEN3.2
N$14
  Bottom 0.203: R14.1 78.2,66.04 79.47,67.31 84.55,67.31 SEN4.2
N$16
  Bottom 0.203: SEN5.2 104.87,67.31 99.79,67.31 R9.1
N$18
  Top 0.203: R13.1 117.57,48.26 117.57,63.5 116.3,64.77 111.22,64.77 111.22,58.42 SEN6.2
N$20
  Bottom 0.203: R11.1 5.81,36.83 7.08,35.56 21.05,35.56 22.32,36.83 SEN7.2
N$22
  Top 0.203: R12.1 68.04,21.59 71.85,21.59 SEN8.2
PANIC  (via drill 0.25)
  Top 0.203: v75.66,43.18 80.74,38.1 89.63,38.1 92.17,35.56 IC1.20 | v95.98,33.02 95.98,16.51 94.71,15.24 PANIC+LIFE.4
  Bottom 0.203: v75.66,43.18 21.05,43.18 R4.1 14.7,49.53 | v95.98,33.02 94.71,34.29 92.17,34.29 IC1.20
RAD_RX  (via drill 0.25)
  Top 0.203: v82.01,5.08 82.01,27.94 80.74,29.21 80.74,33.02 79.47,34.29 IC1.15
  Bottom 0.203: v82.01,5.08 83.28,3.81 108.68,3.81 RADIO.1
RAD_TX  (via drill 0.25)
  Top 0.203: v80.74,7.62 80.74,27.94 79.47,29.21 79.47,31.75 76.93,34.29 IC1.14
  Bottom 0.203: v80.74,7.62 82.01,6.35 108.68,6.35 RADIO.2
RED_LED  (via drill 0.25)
  Top 0.203: IC1.3 48.99,34.29 64.23,19.05 64.23,13.97 68.04,10.16 SENSOR8.5 68.04,8.89 | 19.78,74.93 18.51,76.2 18.51,80.01 17.24,80.01 15.97,78.74 15.97,67.31 10.89,62.23 10.89,52.07 9.62,50.8 SENSOR7.5 | v41.37,72.39 41.37,73.66 42.64,74.93 SENSOR2.5 | v65.5,72.39 65.5,74.93 SENSOR3.5 | v87.09,72.39 87.09,73.66 88.36,74.93 SENSOR4.5 | 118.84,52.07 121.38,49.53 SENSOR6.5 | 118.84,52.07 118.84,67.31 111.22,74.93 SENSOR5.5 | 19.78,74.93 21.05,73.66 v21.05,72.39 | 19.78,74.93 SENSOR1.5 | v111.22,2.54 118.84,10.16 118.84,52.07
  Bottom 0.203: SENSOR5.5 111.22,74.93 108.68,72.39 v87.09,72.39 v65.5,72.39 v41.37,72.39 v21.05,72.39 | v111.22,2.54 83.28,2.54 82.01,3.81 69.31,3.81 69.31,7.62 68.04,8.89 SENSOR8.5
REG1_CLK  (via drill 0.25)
  Top 0.203: v38.83,35.56 38.83,59.69 40.1,60.96 v40.1,68.58 | v59.15,68.58 59.15,62.23 74HC164N_1.8
  Bottom 0.203: v38.83,35.56 43.91,35.56 IC1.1 | v59.15,68.58 v40.1,68.58
REG1_DATA  (via drill 0.25)
  Top 0.203: v41.37,57.15 41.37,40.64 46.45,35.56 IC1.2 | v45.18,58.42 46.45,57.15 46.45,54.61 74HC164N_1.2
  Bottom 0.203: v41.37,57.15 42.64,58.42 v45.18,58.42
REG2_CLK  (via drill 0.25)
  Top 0.203: v108.68,24.13 115.03,30.48 v115.03,63.5
  Bottom 0.203: v108.68,24.13 54.07,24.13 54.07,34.29 IC1.5 | v115.03,63.5 93.44,63.5 92.17,62.23 74HC164N_2.8
REG2_DATA  (via drill 0.25)
  Top 0.203: v71.85,57.15 69.31,59.69 v69.31,69.85 | v42.64,69.85 41.37,68.58 41.37,58.42 40.1,57.15 v40.1,45.72 | v47.72,44.45 56.61,35.56 IC1.6
  Bottom 0.203: IC1.6 56.61,34.29 61.69,29.21 66.77,29.21 68.04,27.94 PROGRAMMER.3 | v71.85,57.15 76.93,57.15 79.47,54.61 74HC164N_2.2 | v69.31,69.85 68.04,71.12 48.99,71.12 47.72,69.85 v42.64,69.85 | v40.1,45.72 41.37,44.45 v47.72,44.45
RESET  (via drill 0.25)
  Top 0.203: v60.42,44.45 60.42,39.37 64.23,35.56 IC1.9 | v36.29,48.26 36.29,54.61 S1.1
  Bottom 0.203: IC1.9 64.23,34.29 66.77,31.75 69.31,31.75 73.12,27.94 PROGRAMMER.5 | R2.1 14.7,53.34 15.97,54.61 28.67,54.61 S1.2 29.94,54.61 35.02,54.61 S1.1 | v60.42,44.45 57.88,46.99 37.56,46.99 v36.29,48.26
SCK
  Bottom 0.203: IC1.8 61.69,34.29 65.5,30.48 68.04,30.48 70.58,27.94 PROGRAMMER.4
SEN_LED1  (via drill 0.25)
  Top 0.203: v23.59,69.85 23.59,62.23 R7.2 | v47.72,71.12 47.72,55.88 48.99,54.61 74HC164N_1.3
  Bottom 0.203: v23.59,69.85 24.86,71.12 v47.72,71.12
SEN_LED2  (via drill 0.25)
  Top 0.203: v52.8,67.31 52.8,55.88 51.53,54.61 74HC164N_1.4
  Bottom 0.203: v52.8,67.31 40.1,67.31 38.83,68.58 23.59,68.58 21.05,66.04 R15.2
SEN_LED3  (via drill 0.25)
  Top 0.203: v54.07,66.04 55.34,64.77 55.34,55.88 54.07,54.61 74HC164N_1.5
  Bottom 0.203: v54.07,66.04 46.45,66.04 R8.2
SEN_LED4
  Top 0.203: 74HC164N_1.6 56.61,54.61 57.88,55.88 57.88,58.42 59.15,59.69 68.04,59.69 68.04,66.04 R14.2
SEN_LED5  (via drill 0.25)
  Top 0.203: v48.99,57.15 v48.99,59.69 | v42.64,57.15 42.64,68.58 47.72,73.66 51.53,73.66 v51.53,81.28
  Bottom 0.203: v48.99,59.69 51.53,59.69 54.07,62.23 74HC164N_1.10 | v42.64,57.15 v48.99,57.15 | v51.53,81.28 115.03,81.28 117.57,78.74 117.57,68.58 95.98,68.58 94.71,67.31 89.63,67.31 R9.2
SEN_LED6
  Bottom 0.203: 74HC164N_1.11 51.53,62.23 48.99,64.77 40.1,64.77 38.83,63.5 12.16,63.5 5.81,57.15 5.81,40.64 26.13,40.64 29.94,36.83 42.64,36.83 45.18,39.37 69.31,39.37 71.85,41.91 75.66,41.91 78.2,44.45 103.6,44.45 107.41,48.26 R13.2
SEN_LED7  (via drill 0.25)
  Top 0.203: v19.78,60.96 19.78,40.64 15.97,36.83 R11.2 | v38.83,60.96 37.56,62.23 v37.56,66.04 | v43.91,66.04 46.45,68.58 46.45,71.12 47.72,72.39 48.99,72.39 48.99,62.23 74HC164N_1.12
  Bottom 0.203: v38.83,60.96 v19.78,60.96 | v37.56,66.04 38.83,67.31 40.1,66.04 v43.91,66.04
SEN_LED8  (via drill 0.25)
  Top 0.203: v42.64,52.07 42.64,55.88 43.91,57.15 43.91,59.69 46.45,62.23 74HC164N_1.13 | v31.21,52.07 29.94,50.8 v29.94,31.75
  Bottom 0.203: v31.21,52.07 v42.64,52.07 | v29.94,31.75 40.1,21.59 57.88,21.59 R12.2
SEN_LED_1
  Top 0.203: SEN1.1 11.52,72.22 SENSOR1.1
SEN_LED_2
  Top 0.203: SEN2.1 38.83,64.77 38.83,73.66 37.56,74.93 SENSOR2.1
SEN_LED_3
  Top 0.203: SEN3.1 62.96,66.04 62.96,72.39 60.42,74.93 SENSOR3.1
SEN_LED_4
  Top 0.203: SEN4.1 85.82,66.04 85.82,72.39 83.28,74.93 SENSOR4.1
SEN_LED_5
  Top 0.203: SENSOR5.1 106.14,64.77 SEN5.1
SEN_LED_6
  Bottom 0.203: SEN6.1 112.49,55.88 113.76,54.61 121.38,54.61 SENSOR6.1
SEN_LED_7  (via drill 0.3)
  Top 0.203: SENSOR7.1 9.43,45.05 v11.14,43.34 | v16.64,43.34 v16.64,38.84
  Bottom 0.203: v11.14,43.34 v16.64,43.34 | v16.64,38.84 21.49,38.84 SEN7.1
SEN_LED_8
  Top 0.203: SEN8.1 73.12,20.32 SENSOR8.1 73.12,8.89
TSOP1  (via drill 0.25)
  Top 0.203: v22.32,50.8 21.05,52.07 21.05,64.77 22.32,66.04 SENSOR1.7
  Bottom 0.203: v22.32,50.8 43.91,50.8 IC1.40
TSOP2  (via drill 0.25)
  Top 0.203: v35.02,49.53 33.75,50.8 v33.75,69.85 | v40.1,69.85 45.18,74.93 SENSOR2.7
  Bottom 0.203: v35.02,49.53 36.29,49.53 37.56,48.26 45.18,48.26 46.45,49.53 IC1.39 | v40.1,69.85 v33.75,69.85
TSOP3  (via drill 0.25)
  Top 0.203: v50.26,69.85 50.26,52.07 48.99,50.8 IC1.38 | v64.23,69.85 68.04,73.66 68.04,74.93 SENSOR3.7
  Bottom 0.203: v64.23,69.85 v50.26,69.85
TSOP4  (via drill 0.25)
  Top 0.203: v71.85,69.85 v71.85,59.69 | v87.09,71.12 90.9,74.93 SENSOR4.7
  Bottom 0.203: v71.85,59.69 69.31,57.15 52.8,57.15 52.8,53.34 51.53,52.07 51.53,50.8 IC1.37 | v71.85,69.85 73.12,71.12 v87.09,71.12
TSOP5  (via drill 0.25)
  Top 0.203: v116.3,63.5 v116.3,50.8 | v120.11,67.31 113.76,73.66 SENSOR5.7
  Bottom 0.203: v116.3,50.8 107.41,50.8 103.6,46.99 90.9,46.99 89.63,48.26 55.34,48.26 54.07,49.53 IC1.36 | v120.11,67.31 v116.3,63.5
TSOP6  (via drill 0.25)
  Top 0.203: v57.88,38.1 57.88,48.26 56.61,49.53 IC1.35
  Bottom 0.203: v57.88,38.1 71.85,38.1 74.39,40.64 115.03,40.64 121.38,46.99 SENSOR6.7
TSOP7  (via drill 0.25)
  Top 0.203: v59.15,40.64 59.15,49.53 IC1.34 | v10.89,41.91 8.35,44.45 8.35,52.07 9.62,53.34 SENSOR7.7
  Bottom 0.203: v59.15,40.64 38.83,40.64 36.29,38.1 29.94,38.1 26.13,41.91 v10.89,41.91
TSOP8  (via drill 0.25)
  Top 0.203: v61.69,41.91 61.69,49.53 IC1.33 | v40.1,41.91 40.1,33.02 54.07,19.05 54.07,17.78 60.42,11.43 65.5,11.43 SENSOR8.7 65.5,8.89
  Bottom 0.203: v40.1,41.91 v61.69,41.91
VCC  (via drill 0.25)
  Top 0.203: 76.93,62.23 76.93,54.61 74HC164N_2.1 | 82.01,76.2 82.01,68.58 84.55,66.04 84.55,64.77 85.82,63.5 87.09,64.77 87.09,69.85 88.36,71.12 92.17,67.31 92.17,64.77 89.63,62.23 74HC164N_2.9 | 82.01,76.2 83.28,77.47 SENSOR4.2 | 76.93,62.23 76.93,73.66 79.47,76.2 82.01,76.2 | 76.93,62.23 74HC164N_2.14 | 123.92,54.61 121.38,57.15 121.38,74.93 115.03,81.28 | 115.03,81.28 113.76,82.55 60.42,82.55 60.42,77.47 SENSOR3.2 | 115.03,81.28 v115.03,80.01 | 28.67,81.28 37.56,81.28 37.56,77.47 | 28.67,81.28 17.24,81.28 14.7,78.74 SENSOR1.2 14.7,77.47 | 24.86,53.34 24.86,49.53 R4.2 | 24.86,53.34 24.86,58.42 v28.67,62.23 28.67,81.28 | 24.86,53.34 R2.2 | 45.18,24.13 45.18,17.78 C3.+ | R10.2 66.77,16.51 71.85,11.43 71.85,7.62 73.12,6.35 SENSOR8.2 | IC1.10 66.77,34.29 62.96,30.48 62.96,27.94 PROGRAMMER.1 | 106.14,11.43 106.14,26.67 103.6,29.21 IC2.3 | 106.14,11.43 108.68,8.89 RADIO.3 | 37.56,77.47 35.02,74.93 35.02,63.5 37.56,60.96 37.56,31.75 45.18,24.13 | 37.56,77.47 SENSOR2.2 | 45.18,24.13 C8.1 | 123.92,54.61 126.46,52.07 126.46,16.51 111.22,1.27 106.14,1.27 106.14,11.43 | 123.92,54.61 SENSOR6.2
  Bottom 0.203: 74HC164N_1.9 56.61,62.23 59.15,59.69 60.42,59.69 62.96,62.23 74HC164N_2.14 76.93,62.23 | 106.14,77.47 103.6,80.01 85.82,80.01 83.28,77.47 SENSOR4.2 | 106.14,77.47 108.68,80.01 v115.03,80.01 | 106.14,77.47 SENSOR5.2 | 74HC164N_1.1 43.91,54.61 42.64,53.34 24.86,53.34 R2.2 | v28.67,62.23 74HC164N_1.14 43.91,62.23 | SENSOR7.2 7.08,45.72 9.62,43.18 13.43,46.99 13.43,50.8 21.05,50.8 22.32,49.53 24.86,49.53 R4.2 | 68.04,15.24 66.77,16.51 R10.2 | 68.04,15.24 69.31,13.97 95.98,13.97 97.25,15.24 PANIC+LIFE.2 | 68.04,15.24 47.72,15.24 45.18,17.78 C3.+ | IC1.10 66.77,34.29 68.04,33.02 69.31,33.02 73.12,29.21 103.6,29.21 IC2.3 | SENSOR8.2 73.12,6.35 75.66,8.89 108.68,8.89 RADIO.3
VSS  (via drill 0.25, 0.3)
  Top 0.203: 109.95,55.88 109.95,40.64 103.6,34.29 | 109.95,55.88 109.95,78.74 108.68,80.01 103.6,80.01 103.6,64.77 SEN5.3 | 109.95,55.88 SEN6.3 | 35.02,33.84 35.02,30.48 D1.C 36.29,29.21 37.56,27.94 37.56,7.62 | 35.02,33.84 35.02,46.99 32.48,49.53 v32.48,64.77 32.39,64.86 v32.39,69.84 | 37.56,7.62 31.21,13.97 23.59,13.97 23.59,11.43 GUN.4 | 37.56,7.62 40.1,5.08 JP1.1 40.1,3.81 40.1,2.54 42.64,2.54 43.91,3.81 43.91,11.43 50.26,17.78 C1.+ | 103.6,34.29 101.06,31.75 v101.06,21.59 | 103.6,34.29 IC2.1 | v34.14,33.84 35.02,33.84
  Bottom 0.203: 83.28,64.77 84.55,64.77 85.82,63.5 87.09,64.77 103.6,64.77 SEN5.3 | 83.28,64.77 76.93,64.77 75.66,63.5 62.96,63.5 60.42,66.04 SEN3.3 | 83.28,64.77 SEN4.3 | v32.48,64.77 36.29,64.77 SEN2.3 | 68.04,17.78 70.58,20.32 SEN8.3 | 68.04,17.78 55.34,17.78 54.07,16.51 51.53,16.51 50.26,17.78 C1.+ | v101.06,21.59 76.93,21.59 73.12,17.78 68.04,17.78 | SEN7.3 27.36,38.62 32.14,33.84 v34.14,33.84 | SEN1.3 22.57,68.27 23.39,69.09 30.14,69.09 30.89,69.84 v32.39,69.84